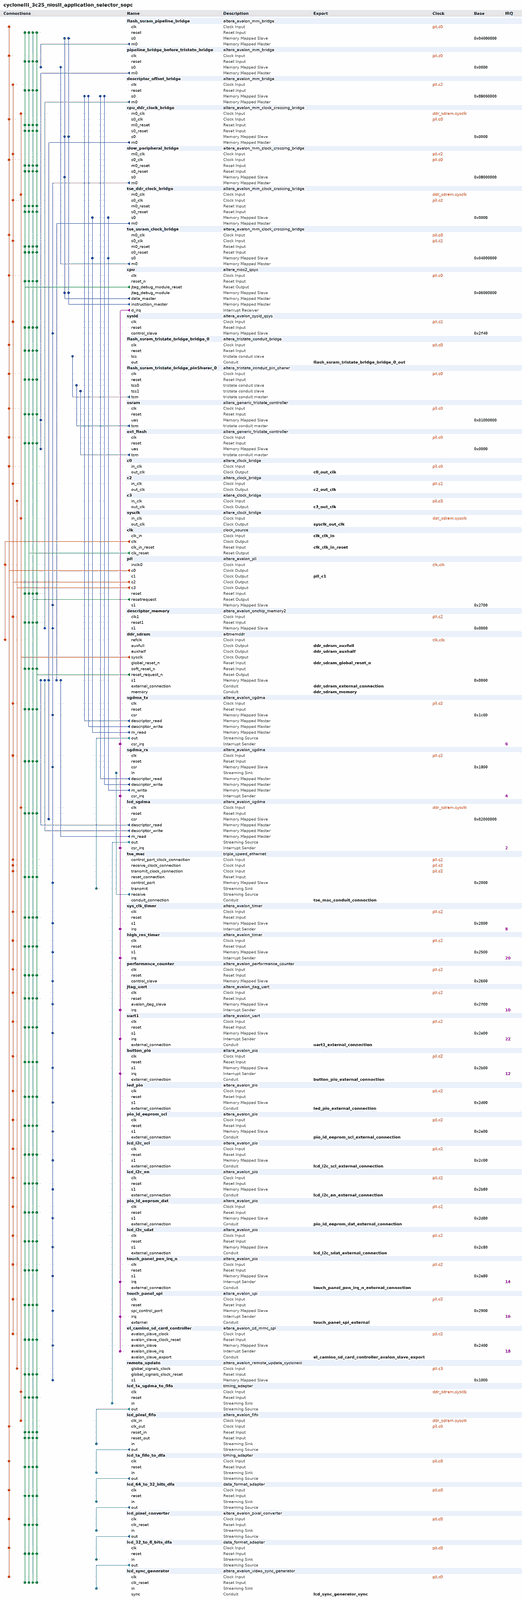
[diagram p0: system contents, whole]
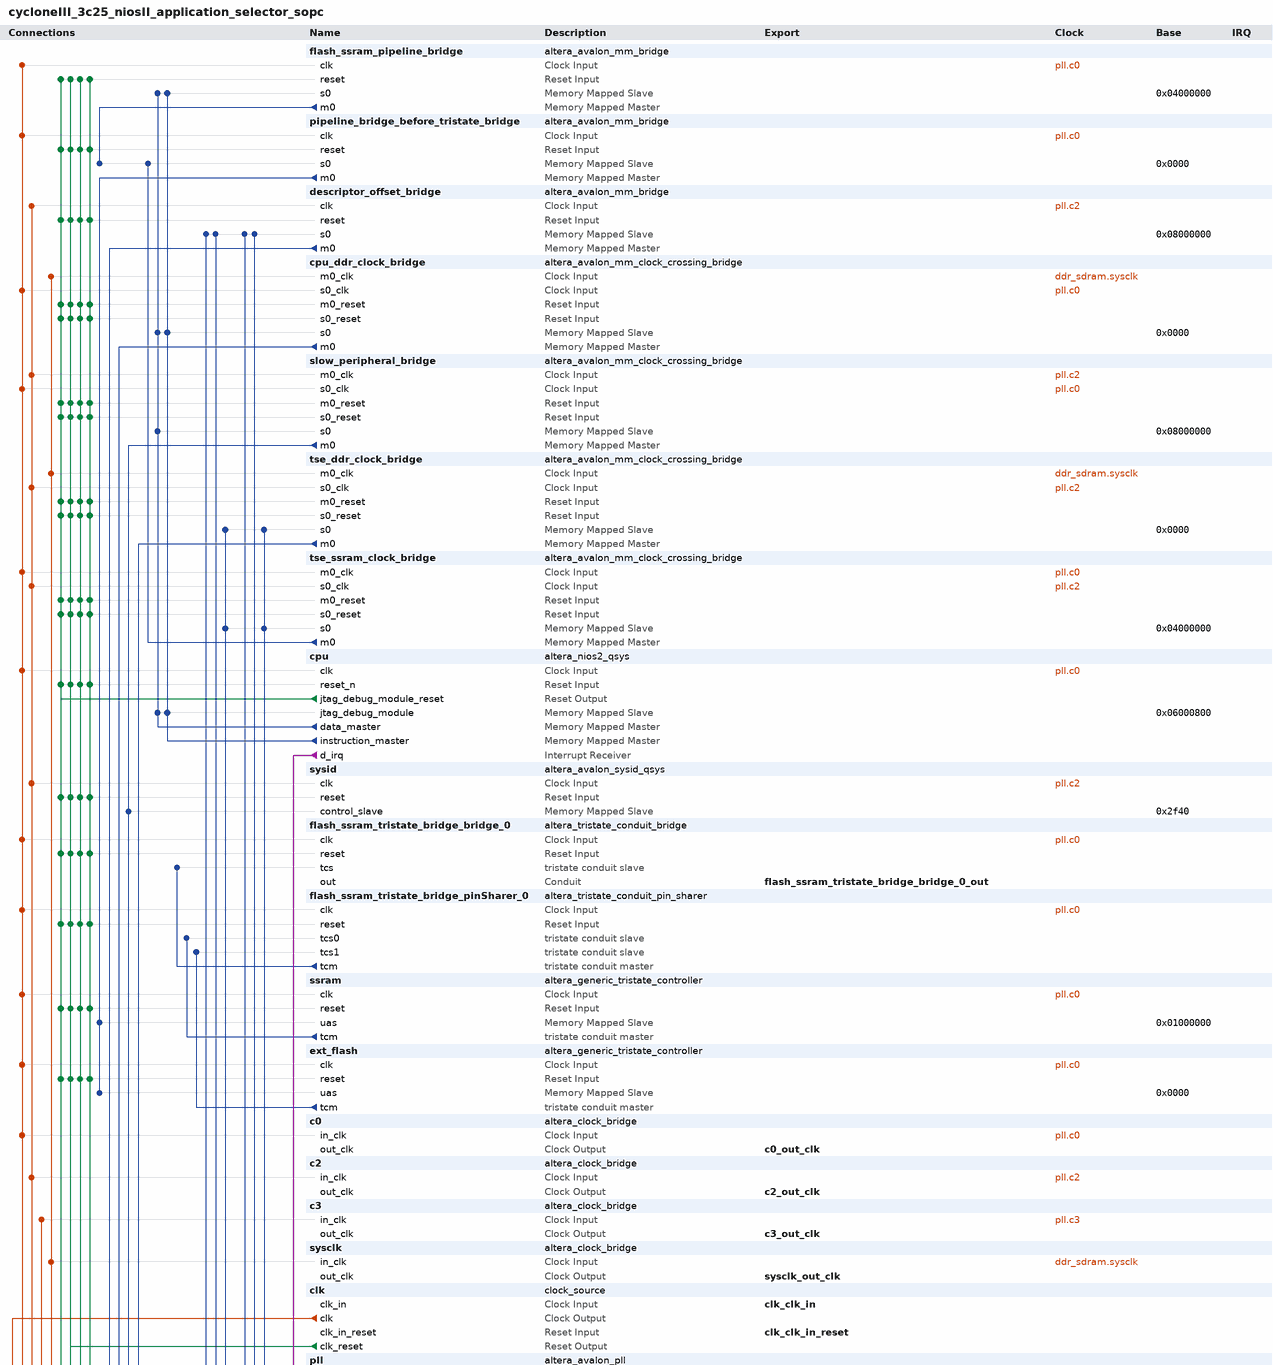
[diagram p1: system contents, upper part]
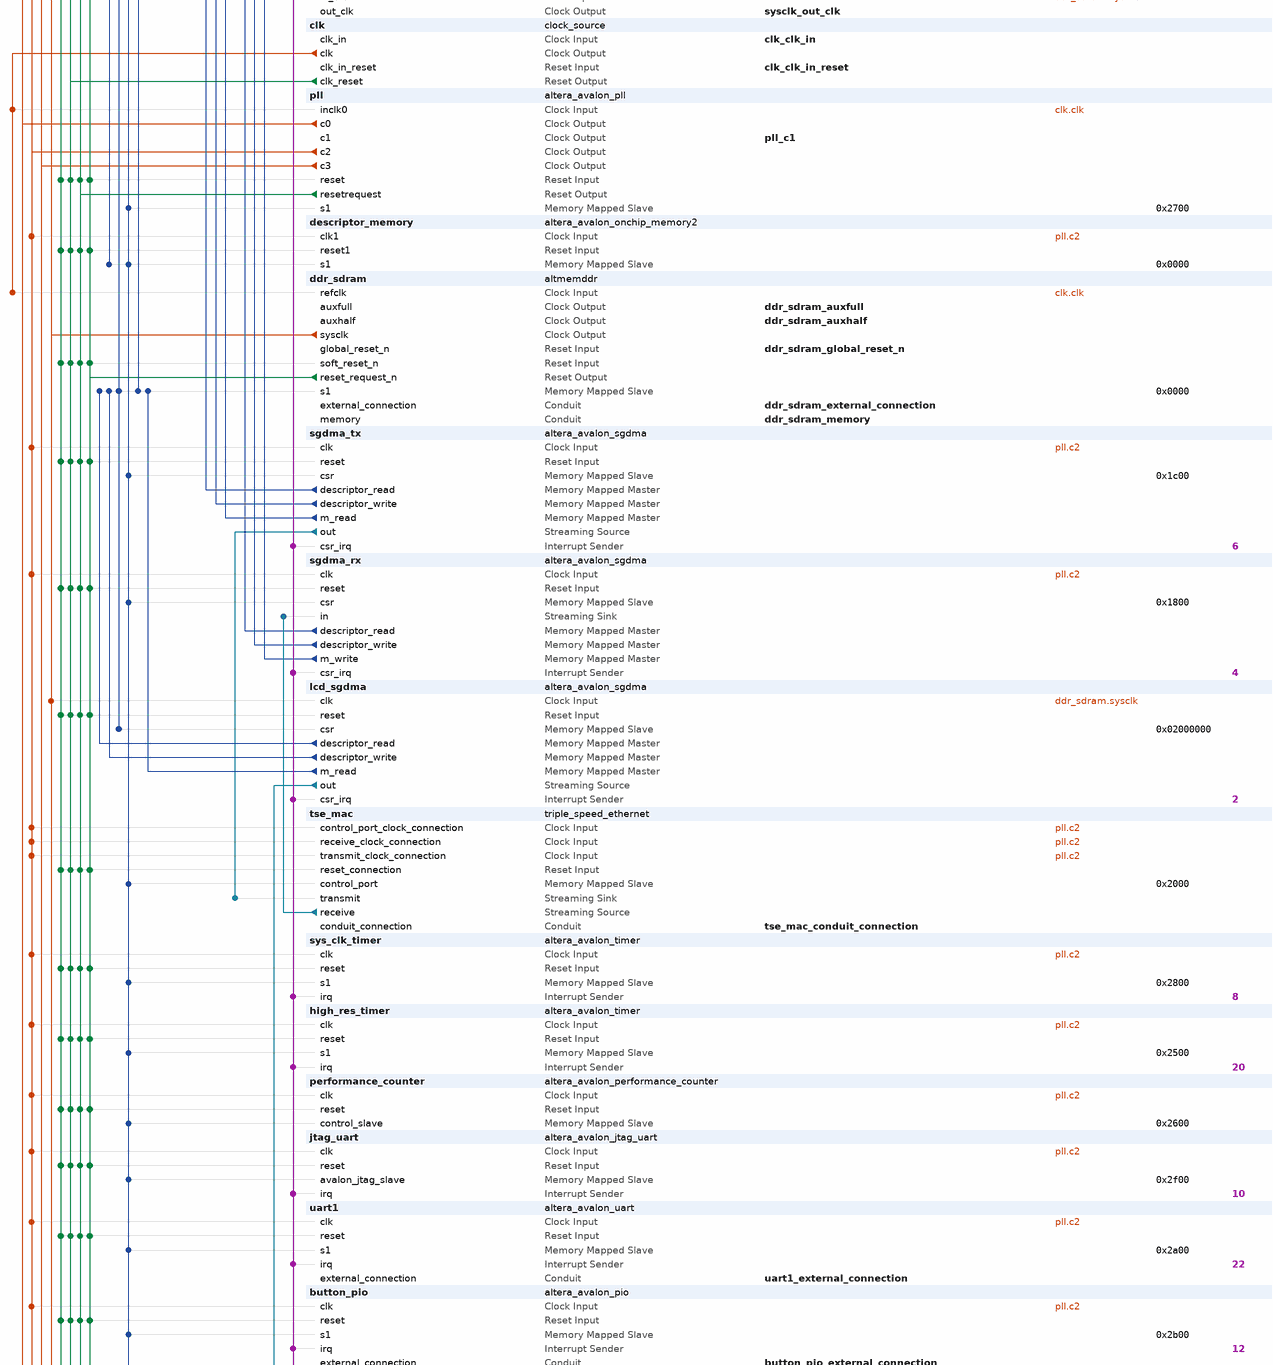
[diagram p2: system contents, middle part]
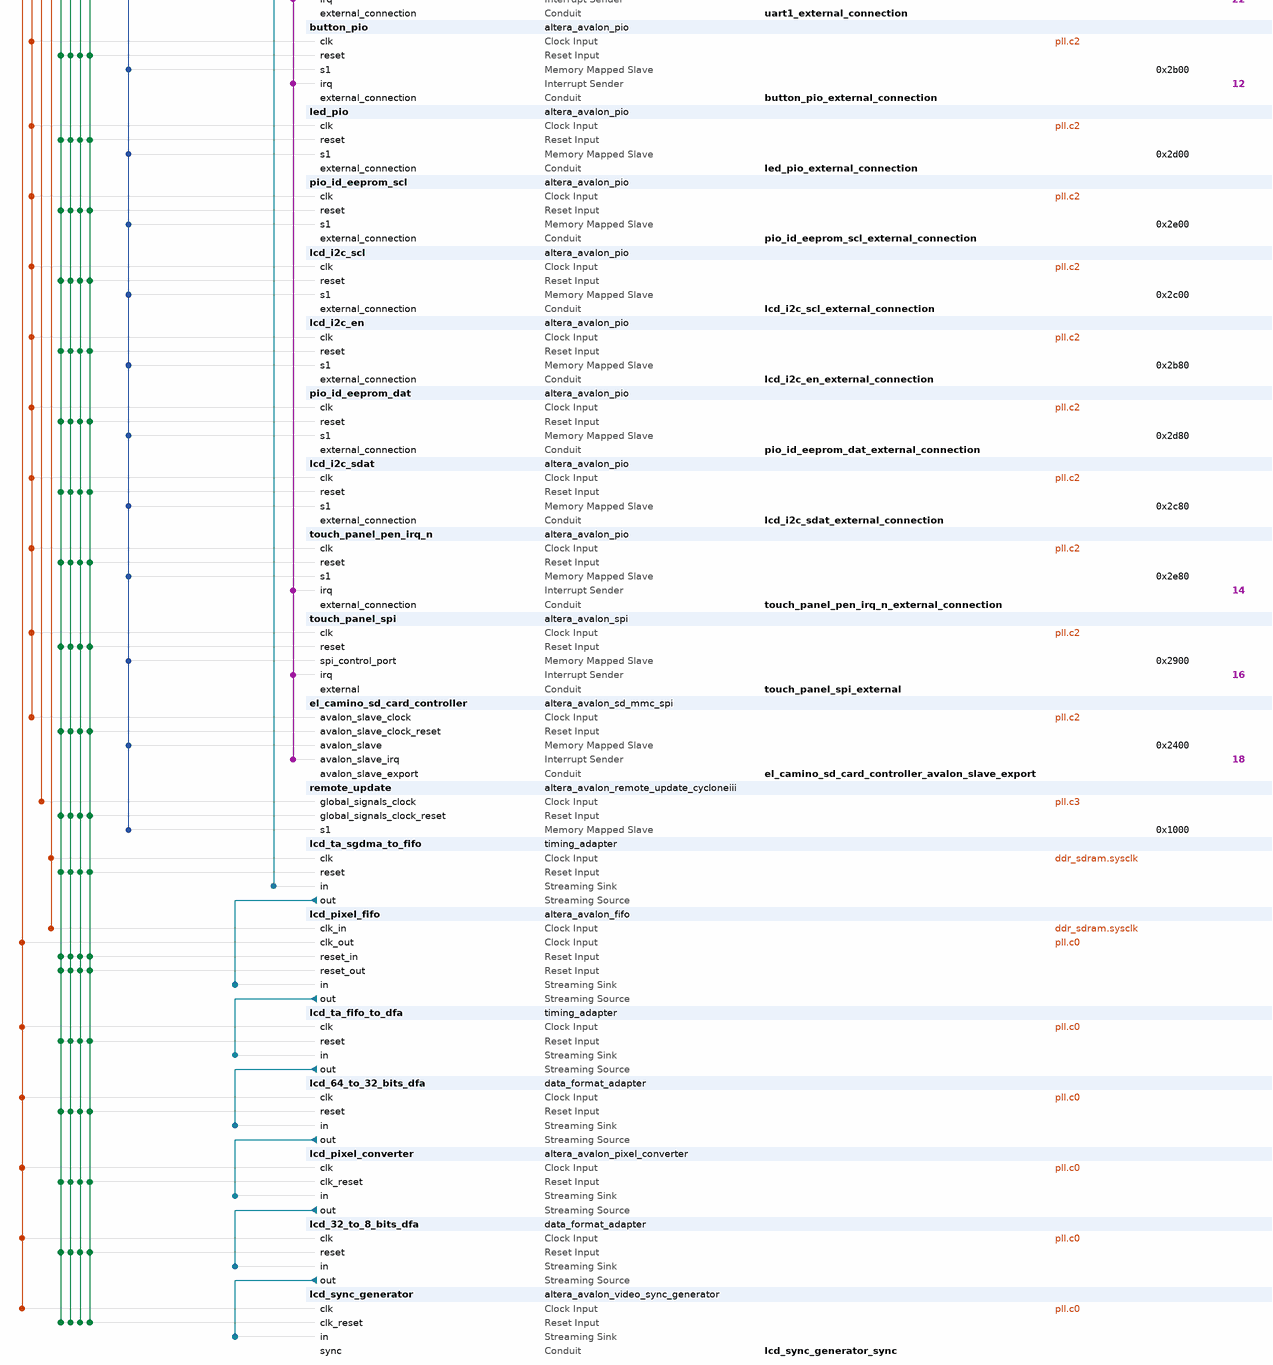
[diagram p3: system contents, lower part]
# Platform Designer (Qsys) system cycloneIII_3c25_niosII_application_selector_sopc, Cyclone III EP3C25F324C8
# Parameters at their usual value, and those the tool derives, are not listed.
package require -exact qsys 12.1
create_system cycloneIII_3c25_niosII_application_selector_sopc
set_project_property DEVICE_FAMILY {Cyclone III}
set_project_property DEVICE EP3C25F324C8

add_instance flash_ssram_pipeline_bridge altera_avalon_mm_bridge 12.1
set_instance_parameter_value flash_ssram_pipeline_bridge DATA_WIDTH 32
set_instance_parameter_value flash_ssram_pipeline_bridge ADDRESS_WIDTH 25
set_instance_parameter_value flash_ssram_pipeline_bridge ADDRESS_UNITS SYMBOLS
set_instance_parameter_value flash_ssram_pipeline_bridge MAX_PENDING_RESPONSES 10

add_instance pipeline_bridge_before_tristate_bridge altera_avalon_mm_bridge 12.1
set_instance_parameter_value pipeline_bridge_before_tristate_bridge DATA_WIDTH 32
set_instance_parameter_value pipeline_bridge_before_tristate_bridge ADDRESS_WIDTH 25
set_instance_parameter_value pipeline_bridge_before_tristate_bridge ADDRESS_UNITS SYMBOLS
set_instance_parameter_value pipeline_bridge_before_tristate_bridge MAX_PENDING_RESPONSES 7

add_instance descriptor_offset_bridge altera_avalon_mm_bridge 12.1
set_instance_parameter_value descriptor_offset_bridge DATA_WIDTH 256
set_instance_parameter_value descriptor_offset_bridge ADDRESS_WIDTH 12
set_instance_parameter_value descriptor_offset_bridge ADDRESS_UNITS SYMBOLS
set_instance_parameter_value descriptor_offset_bridge MAX_PENDING_RESPONSES 4

add_instance cpu_ddr_clock_bridge altera_avalon_mm_clock_crossing_bridge 12.1
set_instance_parameter_value cpu_ddr_clock_bridge DATA_WIDTH 32
set_instance_parameter_value cpu_ddr_clock_bridge ADDRESS_WIDTH 26
set_instance_parameter_value cpu_ddr_clock_bridge MAX_BURST_SIZE 1
set_instance_parameter_value cpu_ddr_clock_bridge COMMAND_FIFO_DEPTH 8
set_instance_parameter_value cpu_ddr_clock_bridge RESPONSE_FIFO_DEPTH 64
set_instance_parameter_value cpu_ddr_clock_bridge MASTER_SYNC_DEPTH 3
set_instance_parameter_value cpu_ddr_clock_bridge SLAVE_SYNC_DEPTH 3

add_instance slow_peripheral_bridge altera_avalon_mm_clock_crossing_bridge 12.1
set_instance_parameter_value slow_peripheral_bridge DATA_WIDTH 32
set_instance_parameter_value slow_peripheral_bridge ADDRESS_WIDTH 14
set_instance_parameter_value slow_peripheral_bridge MAX_BURST_SIZE 1
set_instance_parameter_value slow_peripheral_bridge COMMAND_FIFO_DEPTH 16
set_instance_parameter_value slow_peripheral_bridge RESPONSE_FIFO_DEPTH 64
set_instance_parameter_value slow_peripheral_bridge MASTER_SYNC_DEPTH 3
set_instance_parameter_value slow_peripheral_bridge SLAVE_SYNC_DEPTH 3

add_instance tse_ddr_clock_bridge altera_avalon_mm_clock_crossing_bridge 12.1
set_instance_parameter_value tse_ddr_clock_bridge DATA_WIDTH 32
set_instance_parameter_value tse_ddr_clock_bridge ADDRESS_WIDTH 25
set_instance_parameter_value tse_ddr_clock_bridge MAX_BURST_SIZE 1
set_instance_parameter_value tse_ddr_clock_bridge COMMAND_FIFO_DEPTH 8
set_instance_parameter_value tse_ddr_clock_bridge RESPONSE_FIFO_DEPTH 64
set_instance_parameter_value tse_ddr_clock_bridge MASTER_SYNC_DEPTH 3
set_instance_parameter_value tse_ddr_clock_bridge SLAVE_SYNC_DEPTH 3

add_instance tse_ssram_clock_bridge altera_avalon_mm_clock_crossing_bridge 12.1
set_instance_parameter_value tse_ssram_clock_bridge DATA_WIDTH 32
set_instance_parameter_value tse_ssram_clock_bridge ADDRESS_WIDTH 25
set_instance_parameter_value tse_ssram_clock_bridge MAX_BURST_SIZE 1
set_instance_parameter_value tse_ssram_clock_bridge COMMAND_FIFO_DEPTH 16
set_instance_parameter_value tse_ssram_clock_bridge RESPONSE_FIFO_DEPTH 64
set_instance_parameter_value tse_ssram_clock_bridge MASTER_SYNC_DEPTH 3
set_instance_parameter_value tse_ssram_clock_bridge SLAVE_SYNC_DEPTH 3

add_instance cpu altera_nios2_qsys 12.1
set_instance_parameter_value cpu manuallyAssignCpuID false
set_instance_parameter_value cpu resetOffset 1048576
set_instance_parameter_value cpu resetSlave ext_flash.uas
set_instance_parameter_value cpu exceptionSlave ssram.uas
set_instance_parameter_value cpu breakSlave cpu.jtag_debug_module
set_instance_parameter_value cpu impl Fast
set_instance_parameter_value cpu icache_size 4096

add_instance sysid altera_avalon_sysid_qsys 12.1
set_instance_parameter_value sysid id 0

add_instance flash_ssram_tristate_bridge_bridge_0 altera_tristate_conduit_bridge 12.1

add_instance flash_ssram_tristate_bridge_pinSharer_0 altera_tristate_conduit_pin_sharer 12.1
set_instance_parameter_value flash_ssram_tristate_bridge_pinSharer_0 NUM_INTERFACES 2
set_instance_parameter_value flash_ssram_tristate_bridge_pinSharer_0 MODULE_ORIGIN_LIST ext_flash.tcm,ext_flash.tcm,ext_flash.tcm,ext_flash.tcm,ext_flash.tcm,ssram.tcm,ssram.tcm,ssram.tcm,ssram.tcm,ssram.tcm,ssram.tcm,ssram.tcm,ssram.tcm
set_instance_parameter_value flash_ssram_tristate_bridge_pinSharer_0 SIGNAL_ORIGIN_LIST address,read_n,write_n,data,chipselect_n,chipselect_n,byteenable_n,outputenable_n,write_n,data,address,reset_n,begintransfer_n
set_instance_parameter_value flash_ssram_tristate_bridge_pinSharer_0 SHARED_SIGNAL_LIST flash_ssram_tristate_bridge_address,read_n_to_the_ext_flash,write_n_to_the_ext_flash,flash_ssram_tristate_bridge_data,select_n_to_the_ext_flash,chipenable1_n_to_the_ssram,bw_n_to_the_ssram,outputenable_n_to_the_ssram,bwe_n_to_the_ssram,flash_ssram_tristate_bridge_data,flash_ssram_tristate_bridge_address,reset_n_to_the_ssram,adsc_n_to_the_ssram

add_instance ssram altera_generic_tristate_controller 12.1
set_instance_parameter_value ssram TCM_ADDRESS_W 20
set_instance_parameter_value ssram TCM_DATA_W 32
set_instance_parameter_value ssram TCM_BYTEENABLE_W 4
set_instance_parameter_value ssram TCM_READ_WAIT 0
set_instance_parameter_value ssram TCM_WRITE_WAIT 0
set_instance_parameter_value ssram TCM_SETUP_WAIT 0
set_instance_parameter_value ssram TCM_DATA_HOLD 0
set_instance_parameter_value ssram TCM_MAX_PENDING_READ_TRANSACTIONS 5
set_instance_parameter_value ssram TCM_TURNAROUND_TIME 2
set_instance_parameter_value ssram TCM_TIMING_UNITS 1
set_instance_parameter_value ssram TCM_READLATENCY 4
set_instance_parameter_value ssram TCM_SYMBOLS_PER_WORD 4
set_instance_parameter_value ssram USE_READ 0
set_instance_parameter_value ssram USE_BEGINTRANSFER 1
set_instance_parameter_value ssram USE_BYTEENABLE 1
set_instance_parameter_value ssram USE_OUTPUTENABLE 1
set_instance_parameter_value ssram USE_RESET_OUTPUT 1
set_instance_parameter_value ssram ACTIVE_LOW_READ 0
set_instance_parameter_value ssram ACTIVE_LOW_BYTEENABLE 1
set_instance_parameter_value ssram ACTIVE_LOW_OUTPUTENABLE 1
set_instance_parameter_value ssram ACTIVE_LOW_BEGINTRANSFER 1
set_instance_parameter_value ssram ACTIVE_LOW_RESET_OUTPUT 1
set_instance_parameter_value ssram CHIPSELECT_THROUGH_READLATENCY 1
set_instance_parameter_value ssram MODULE_ASSIGNMENT_KEYS embeddedsw.configuration.hwClassnameDriverSupportList,embeddedsw.CMacro.SRAM_MEMORY_SIZE,embeddedsw.CMacro.SRAM_MEMORY_UNITS,embeddedsw.CMacro.SSRAM_DATA_WIDTH,embeddedsw.CMacro.SSRAM_READ_LATENCY,embeddedsw.memoryInfo.MEM_INIT_DATA_WIDTH,embeddedsw.memoryInfo.HAS_BYTE_LANE,embeddedsw.memoryInfo.GENERATE_DAT_SYM,embeddedsw.memoryInfo.DAT_SYM_INSTALL_DIR
set_instance_parameter_value ssram MODULE_ASSIGNMENT_VALUES altera_avalon_lan91c111:altera_avalon_cfi_flash,1,1048576,32,2,32,1,1,SIM_DIR
set_instance_parameter_value ssram INTERFACE_ASSIGNMENT_KEYS embeddedsw.configuration.isMemoryDevice
set_instance_parameter_value ssram INTERFACE_ASSIGNMENT_VALUES 1

add_instance ext_flash altera_generic_tristate_controller 12.1
set_instance_parameter_value ext_flash TCM_ADDRESS_W 24
set_instance_parameter_value ext_flash TCM_DATA_W 16
set_instance_parameter_value ext_flash TCM_BYTEENABLE_W 2
set_instance_parameter_value ext_flash TCM_READ_WAIT 100
set_instance_parameter_value ext_flash TCM_WRITE_WAIT 100
set_instance_parameter_value ext_flash TCM_SETUP_WAIT 25
set_instance_parameter_value ext_flash TCM_DATA_HOLD 20
set_instance_parameter_value ext_flash TCM_MAX_PENDING_READ_TRANSACTIONS 3
set_instance_parameter_value ext_flash TCM_TURNAROUND_TIME 2
set_instance_parameter_value ext_flash TCM_TIMING_UNITS 0
set_instance_parameter_value ext_flash TCM_READLATENCY 2
set_instance_parameter_value ext_flash TCM_SYMBOLS_PER_WORD 2
set_instance_parameter_value ext_flash USE_READ 1
set_instance_parameter_value ext_flash USE_BEGINTRANSFER 0
set_instance_parameter_value ext_flash USE_BYTEENABLE 0
set_instance_parameter_value ext_flash USE_OUTPUTENABLE 0
set_instance_parameter_value ext_flash ACTIVE_LOW_READ 1
set_instance_parameter_value ext_flash ACTIVE_LOW_BYTEENABLE 0
set_instance_parameter_value ext_flash ACTIVE_LOW_OUTPUTENABLE 0
set_instance_parameter_value ext_flash ACTIVE_LOW_BEGINTRANSFER 0
set_instance_parameter_value ext_flash CHIPSELECT_THROUGH_READLATENCY 0
set_instance_parameter_value ext_flash MODULE_ASSIGNMENT_KEYS embeddedsw.configuration.hwClassnameDriverSupportList,embeddedsw.configuration.hwClassnameDriverSupportDefault,embeddedsw.CMacro.SETUP_VALUE,embeddedsw.CMacro.WAIT_VALUE,embeddedsw.CMacro.HOLD_VALUE,embeddedsw.CMacro.TIMING_UNITS,embeddedsw.CMacro.SIZE,embeddedsw.memoryInfo.MEM_INIT_DATA_WIDTH,embeddedsw.memoryInfo.HAS_BYTE_LANE,embeddedsw.memoryInfo.IS_FLASH,embeddedsw.memoryInfo.GENERATE_DAT_SYM,embeddedsw.memoryInfo.GENERATE_FLASH,embeddedsw.memoryInfo.DAT_SYM_INSTALL_DIR,embeddedsw.memoryInfo.FLASH_INSTALL_DIR
set_instance_parameter_value ext_flash MODULE_ASSIGNMENT_VALUES {altera_avalon_lan91c111:altera_avalon_cfi_flash,altera_avalon_cfi_flash,25,100,20,"ns",16777216u,16,1,1,1,1,SIM_DIR,APP_DIR}
set_instance_parameter_value ext_flash INTERFACE_ASSIGNMENT_KEYS embeddedsw.configuration.isFlash,embeddedsw.configuration.isMemoryDevice,embeddedsw.configuration.isNonVolatileStorage
set_instance_parameter_value ext_flash INTERFACE_ASSIGNMENT_VALUES 1,1,1

add_instance c0 altera_clock_bridge 12.1
set_instance_parameter_value c0 DERIVED_CLOCK_RATE 100000000
set_instance_parameter_value c0 EXPLICIT_CLOCK_RATE 0

add_instance c2 altera_clock_bridge 12.1
set_instance_parameter_value c2 DERIVED_CLOCK_RATE 60000000
set_instance_parameter_value c2 EXPLICIT_CLOCK_RATE 0

add_instance c3 altera_clock_bridge 12.1
set_instance_parameter_value c3 DERIVED_CLOCK_RATE 40000000
set_instance_parameter_value c3 EXPLICIT_CLOCK_RATE 0

add_instance sysclk altera_clock_bridge 12.1
set_instance_parameter_value sysclk DERIVED_CLOCK_RATE 66500000
set_instance_parameter_value sysclk EXPLICIT_CLOCK_RATE 0

add_instance clk clock_source 12.1
set_instance_parameter_value clk clockFrequency 50000000

add_instance pll altera_avalon_pll 12.1
set_instance_parameter_value pll c0 {tap c0 mult 2 div 1 phase 0 enabled true inputfreq 50000000 outputfreq 100000000}
set_instance_parameter_value pll c1 {tap c1 mult 2 div 1 phase -2000 enabled true inputfreq 50000000 outputfreq 100000000}
set_instance_parameter_value pll c2 {tap c2 mult 6 div 5 phase 0 enabled true inputfreq 50000000 outputfreq 60000000}
set_instance_parameter_value pll c3 {tap c3 mult 4 div 5 phase 0 enabled true inputfreq 50000000 outputfreq 40000000}
set_instance_parameter_value pll c4 {tap c4 mult 1 div 1 phase 0 enabled false inputfreq 0 outputfreq 0}
set_instance_parameter_value pll c5 {tap c5 mult 1 div 1 phase 0 enabled false inputfreq 0 outputfreq 0}
set_instance_parameter_value pll c6 {tap c6 mult 1 div 1 phase 0 enabled false inputfreq 0 outputfreq 0}
set_instance_parameter_value pll c7 {tap c7 mult 1 div 1 phase 0 enabled false inputfreq 0 outputfreq 0}
set_instance_parameter_value pll c8 {tap c8 mult 1 div 1 phase 0 enabled false inputfreq 0 outputfreq 0}
set_instance_parameter_value pll c9 {tap c9 mult 1 div 1 phase 0 enabled false inputfreq 0 outputfreq 0}
set_instance_parameter_value pll e0 {tap e0 mult 1 div 1 phase 0 enabled false inputfreq 0 outputfreq 0}
set_instance_parameter_value pll e1 {tap e1 mult 1 div 1 phase 0 enabled false inputfreq 0 outputfreq 0}
set_instance_parameter_value pll e2 {tap e2 mult 1 div 1 phase 0 enabled false inputfreq 0 outputfreq 0}
set_instance_parameter_value pll e3 {tap e3 mult 1 div 1 phase 0 enabled false inputfreq 0 outputfreq 0}
set_instance_parameter_value pll inputClockRate 50000000
set_instance_parameter_value pll lockedOutputPortOption Export
set_instance_parameter_value pll pfdenaInputPortOption Register
set_instance_parameter_value pll resetInputPortOption Register

add_instance descriptor_memory altera_avalon_onchip_memory2 12.1
set_instance_parameter_value descriptor_memory dataWidth 32
set_instance_parameter_value descriptor_memory dualPort false
set_instance_parameter_value descriptor_memory initMemContent true
set_instance_parameter_value descriptor_memory initializationFileName descriptor_memory
set_instance_parameter_value descriptor_memory memorySize 4096

add_instance ddr_sdram altmemddr 12.1
set_instance_parameter_value ddr_sdram pipeline_commands false
set_instance_parameter_value ddr_sdram debug_en false
set_instance_parameter_value ddr_sdram export_debug_port false
set_instance_parameter_value ddr_sdram use_generated_memory_model true
set_instance_parameter_value ddr_sdram dedicated_memory_clk_phase_label {Dedicated memory clock phase:}
set_instance_parameter_value ddr_sdram mem_if_clk_mhz 133.0
set_instance_parameter_value ddr_sdram quartus_project_exists false
set_instance_parameter_value ddr_sdram local_if_drate Half
set_instance_parameter_value ddr_sdram enable_v72_rsu false
set_instance_parameter_value ddr_sdram local_if_clk_mhz_label 66.5
set_instance_parameter_value ddr_sdram new_variant false
set_instance_parameter_value ddr_sdram mem_if_memtype {DDR SDRAM}
set_instance_parameter_value ddr_sdram pll_ref_clk_mhz 50.0
set_instance_parameter_value ddr_sdram mem_if_clk_ps_label {(7519 ps)}
set_instance_parameter_value ddr_sdram family {Cyclone III}
set_instance_parameter_value ddr_sdram project_family {Cyclone III}
set_instance_parameter_value ddr_sdram speed_grade 8
set_instance_parameter_value ddr_sdram dedicated_memory_clk_phase 0
set_instance_parameter_value ddr_sdram pll_ref_clk_ps_label {(20000 ps)}
set_instance_parameter_value ddr_sdram avalon_burst_length 1
set_instance_parameter_value ddr_sdram mem_if_clk_pair_count 1
set_instance_parameter_value ddr_sdram mem_if_cs_per_dimm 1
set_instance_parameter_value ddr_sdram pre_latency_label {Fix read latency at:}
set_instance_parameter_value ddr_sdram dedicated_memory_clk_en false
set_instance_parameter_value ddr_sdram mirror_addressing 0
set_instance_parameter_value ddr_sdram mem_if_bankaddr_width 2
set_instance_parameter_value ddr_sdram register_control_word_9 0000
set_instance_parameter_value ddr_sdram mem_if_rowaddr_width 13
set_instance_parameter_value ddr_sdram mem_dyn_deskew_en false
set_instance_parameter_value ddr_sdram post_latency_label {cycles (0 cycles=minimum latency, non-deterministic)}
set_instance_parameter_value ddr_sdram mem_if_dm_pins_en Yes
set_instance_parameter_value ddr_sdram local_if_dwidth_label 64
set_instance_parameter_value ddr_sdram register_control_word_7 0000
set_instance_parameter_value ddr_sdram register_control_word_8 0000
set_instance_parameter_value ddr_sdram mem_if_preset {PSC A2S56D40CTP-G5}
set_instance_parameter_value ddr_sdram mem_if_pchaddr_bit 10
set_instance_parameter_value ddr_sdram WIDTH_RATIO 4
set_instance_parameter_value ddr_sdram vendor Other
set_instance_parameter_value ddr_sdram register_control_word_3 0000
set_instance_parameter_value ddr_sdram register_control_word_4 0000
set_instance_parameter_value ddr_sdram chip_or_dimm {Discrete Device}
set_instance_parameter_value ddr_sdram register_control_word_5 0000
set_instance_parameter_value ddr_sdram register_control_word_6 0000
set_instance_parameter_value ddr_sdram mem_fmax 200.0
set_instance_parameter_value ddr_sdram register_control_word_0 0000
set_instance_parameter_value ddr_sdram register_control_word_size 4
set_instance_parameter_value ddr_sdram register_control_word_1 0000
set_instance_parameter_value ddr_sdram register_control_word_2 0000
set_instance_parameter_value ddr_sdram register_control_word_11 0000
set_instance_parameter_value ddr_sdram register_control_word_10 0000
set_instance_parameter_value ddr_sdram mem_if_cs_width 1
set_instance_parameter_value ddr_sdram mem_if_preset_rlat 0
set_instance_parameter_value ddr_sdram mem_if_cs_per_rank 1
set_instance_parameter_value ddr_sdram fast_simulation_en FAST
set_instance_parameter_value ddr_sdram register_control_word_15 0000
set_instance_parameter_value ddr_sdram register_control_word_14 0000
set_instance_parameter_value ddr_sdram mem_if_dwidth 16
set_instance_parameter_value ddr_sdram mem_if_dq_per_dqs 8
set_instance_parameter_value ddr_sdram mem_if_coladdr_width 9
set_instance_parameter_value ddr_sdram register_control_word_13 0000
set_instance_parameter_value ddr_sdram register_control_word_12 0000
set_instance_parameter_value ddr_sdram mem_tiha_ps 600
set_instance_parameter_value ddr_sdram mem_tdsh_ck 0.2
set_instance_parameter_value ddr_sdram mem_if_trfc_ns 70.0
set_instance_parameter_value ddr_sdram mem_tqh_ck 0.36
set_instance_parameter_value ddr_sdram mem_tisa_ps 600
set_instance_parameter_value ddr_sdram mem_tdss_ck 0.2
set_instance_parameter_value ddr_sdram mem_trtp_ns 0.0
set_instance_parameter_value ddr_sdram mem_if_tinit_us 200.0
set_instance_parameter_value ddr_sdram mem_if_trcd_ns 15.0
set_instance_parameter_value ddr_sdram mem_if_twtr_ck 2
set_instance_parameter_value ddr_sdram mem_trrd_ns 0.0
set_instance_parameter_value ddr_sdram mem_tdqss_ck 0.28
set_instance_parameter_value ddr_sdram mem_tqhs_ps 500
set_instance_parameter_value ddr_sdram mem_tdsa_ps 400
set_instance_parameter_value ddr_sdram mem_tac_ps 700
set_instance_parameter_value ddr_sdram mem_tdha_ps 400
set_instance_parameter_value ddr_sdram mem_if_tras_ns 40.0
set_instance_parameter_value ddr_sdram mem_if_twr_ns 15.0
set_instance_parameter_value ddr_sdram mem_tdqsck_ps 550
set_instance_parameter_value ddr_sdram mem_if_trp_ns 15.0
set_instance_parameter_value ddr_sdram mem_tdqsq_ps 400
set_instance_parameter_value ddr_sdram mem_if_tmrd_ns 10.0
set_instance_parameter_value ddr_sdram mem_tfaw_ns 0.0
set_instance_parameter_value ddr_sdram mem_if_trefi_us 7.0
set_instance_parameter_value ddr_sdram mem_tcl_40_fmax 533.0
set_instance_parameter_value ddr_sdram mem_odt Disabled
set_instance_parameter_value ddr_sdram mp_WLH_percent 0.6
set_instance_parameter_value ddr_sdram mem_drv_str Normal
set_instance_parameter_value ddr_sdram mp_DH_percent 0.5
set_instance_parameter_value ddr_sdram input_period 0
set_instance_parameter_value ddr_sdram mp_QH_percent 0.5
set_instance_parameter_value ddr_sdram mp_QHS_percent 0.5
set_instance_parameter_value ddr_sdram mem_tcl_30_fmax 200.0
set_instance_parameter_value ddr_sdram ac_clk_select 90
set_instance_parameter_value ddr_sdram mp_DQSQ_percent 0.65
set_instance_parameter_value ddr_sdram mp_DS_percent 0.6
set_instance_parameter_value ddr_sdram pll_reconfig_ports_en false
set_instance_parameter_value ddr_sdram mem_btype Sequential
set_instance_parameter_value ddr_sdram mp_IS_percent 0.7
set_instance_parameter_value ddr_sdram mem_tcl 3.0
set_instance_parameter_value ddr_sdram mp_DQSS_percent 0.5
set_instance_parameter_value ddr_sdram export_bank_info false
set_instance_parameter_value ddr_sdram mp_DSS_percent 0.6
set_instance_parameter_value ddr_sdram mem_dll_en Yes
set_instance_parameter_value ddr_sdram ac_phase 90
set_instance_parameter_value ddr_sdram mem_if_oct_en false
set_instance_parameter_value ddr_sdram mem_tcl_60_fmax 533.0
set_instance_parameter_value ddr_sdram mp_DSH_percent 0.6
set_instance_parameter_value ddr_sdram mem_if_dqsn_en false
set_instance_parameter_value ddr_sdram enable_mp_calibration true
set_instance_parameter_value ddr_sdram mp_IH_percent 0.6
set_instance_parameter_value ddr_sdram mem_tcl_15_fmax 533.0
set_instance_parameter_value ddr_sdram dll_external false
set_instance_parameter_value ddr_sdram mem_bl 4
set_instance_parameter_value ddr_sdram mp_WLS_percent 0.7
set_instance_parameter_value ddr_sdram mem_tcl_50_fmax 533.0
set_instance_parameter_value ddr_sdram mp_DQSCK_percent 0.5
set_instance_parameter_value ddr_sdram mem_tcl_25_fmax 200.0
set_instance_parameter_value ddr_sdram mem_tcl_20_fmax 133.333
set_instance_parameter_value ddr_sdram cfg_reorder_data true
set_instance_parameter_value ddr_sdram ctl_ecc_en false
set_instance_parameter_value ddr_sdram ctl_hrb_en false
set_instance_parameter_value ddr_sdram ref_clk_source clk
set_instance_parameter_value ddr_sdram cfg_data_reordering_type INTER_BANK
set_instance_parameter_value ddr_sdram ctl_powerdn_en false
set_instance_parameter_value ddr_sdram multicast_wr_en false
set_instance_parameter_value ddr_sdram auto_powerdn_cycles 0
set_instance_parameter_value ddr_sdram ctl_self_refresh_en false
set_instance_parameter_value ddr_sdram cfg_starve_limit 10
set_instance_parameter_value ddr_sdram ctl_latency 5
set_instance_parameter_value ddr_sdram tool_context SOPC_BUILDER
set_instance_parameter_value ddr_sdram mem_addr_mapping CHIP_ROW_BANK_COL
set_instance_parameter_value ddr_sdram burst_merge_en false
set_instance_parameter_value ddr_sdram user_refresh_en false
set_instance_parameter_value ddr_sdram qsys_mode true
set_instance_parameter_value ddr_sdram clk_source_sharing_en false
set_instance_parameter_value ddr_sdram ctl_lookahead_depth 4
set_instance_parameter_value ddr_sdram ctl_autopch_en false
set_instance_parameter_value ddr_sdram ctl_dynamic_bank_allocation false
set_instance_parameter_value ddr_sdram ctl_dynamic_bank_num 4
set_instance_parameter_value ddr_sdram local_if_type_avalon true
set_instance_parameter_value ddr_sdram csr_en false
set_instance_parameter_value ddr_sdram ctl_auto_correct_en false
set_instance_parameter_value ddr_sdram auto_powerdn_en false
set_instance_parameter_value ddr_sdram phy_if_type_afi true
set_instance_parameter_value ddr_sdram controller_type hp_ctl
set_instance_parameter_value ddr_sdram max_local_size 4
set_instance_parameter_value ddr_sdram mem_srtr Normal
set_instance_parameter_value ddr_sdram mem_mpr_loc {Predefined Pattern}
set_instance_parameter_value ddr_sdram dss_tinit_rst_us 200.0
set_instance_parameter_value ddr_sdram mem_tcl_90_fmax 400.0
set_instance_parameter_value ddr_sdram mem_rtt_wr {Dynamic ODT off}
set_instance_parameter_value ddr_sdram mem_tcl_100_fmax 400.0
set_instance_parameter_value ddr_sdram mem_pasr {Full Array}
set_instance_parameter_value ddr_sdram mem_asrm {Manual SR Reference (SRT)}
set_instance_parameter_value ddr_sdram mem_mpr_oper {Predefined Pattern}
set_instance_parameter_value ddr_sdram mem_tcl_80_fmax 400.0
set_instance_parameter_value ddr_sdram mem_drv_impedance RZQ/7
set_instance_parameter_value ddr_sdram mem_rtt_nom {ODT Disabled}
set_instance_parameter_value ddr_sdram mem_tcl_70_fmax 400.0
set_instance_parameter_value ddr_sdram mem_wtcl 5.0
set_instance_parameter_value ddr_sdram mem_dll_pch {Fast Exit}
set_instance_parameter_value ddr_sdram mem_atcl Disabled
set_instance_parameter_value ddr_sdram board_settings_valid true
set_instance_parameter_value ddr_sdram t_IH 0.6
set_instance_parameter_value ddr_sdram board_intra_DQS_group_skew 0.02
set_instance_parameter_value ddr_sdram isi_DQS 0.0
set_instance_parameter_value ddr_sdram addr_cmd_slew_rate 1.0
set_instance_parameter_value ddr_sdram board_tpd_inter_DIMM 0.05
set_instance_parameter_value ddr_sdram board_addresscmd_CK_skew 0.0
set_instance_parameter_value ddr_sdram t_DS_calculated 0.400
set_instance_parameter_value ddr_sdram isi_addresscmd_hold 0.0
set_instance_parameter_value ddr_sdram t_IS 0.6
set_instance_parameter_value ddr_sdram restore_default_toggle false
set_instance_parameter_value ddr_sdram dqs_dqsn_slew_rate 2.0
set_instance_parameter_value ddr_sdram dq_slew_rate 1.0
set_instance_parameter_value ddr_sdram board_inter_DQS_group_skew 0.02
set_instance_parameter_value ddr_sdram isi_addresscmd_setup 0.0
set_instance_parameter_value ddr_sdram board_minCK_DQS_skew -0.01
set_instance_parameter_value ddr_sdram t_IS_calculated 0.600
set_instance_parameter_value ddr_sdram num_slots_or_devices 1
set_instance_parameter_value ddr_sdram board_maxCK_DQS_skew 0.01
set_instance_parameter_value ddr_sdram board_skew_ps 20
set_instance_parameter_value ddr_sdram t_DH 0.4
set_instance_parameter_value ddr_sdram ck_ckn_slew_rate 2.0
set_instance_parameter_value ddr_sdram isi_DQ 0.0
set_instance_parameter_value ddr_sdram t_IH_calculated 0.600
set_instance_parameter_value ddr_sdram t_DH_calculated 0.400
set_instance_parameter_value ddr_sdram t_DS 0.4

add_instance sgdma_tx altera_avalon_sgdma 12.1
set_instance_parameter_value sgdma_tx enableBurstTransfers false
set_instance_parameter_value sgdma_tx enableUnalignedTransfers false
set_instance_parameter_value sgdma_tx readBlockDataWidth 32
set_instance_parameter_value sgdma_tx sinkErrorWidth 0
set_instance_parameter_value sgdma_tx sourceErrorWidth 1
set_instance_parameter_value sgdma_tx transferMode MEMORY_TO_STREAM
set_instance_parameter_value sgdma_tx writeBurstcountWidth 4

add_instance sgdma_rx altera_avalon_sgdma 12.1
set_instance_parameter_value sgdma_rx enableBurstTransfers false
set_instance_parameter_value sgdma_rx enableUnalignedTransfers false
set_instance_parameter_value sgdma_rx readBlockDataWidth 32
set_instance_parameter_value sgdma_rx sinkErrorWidth 6
set_instance_parameter_value sgdma_rx sourceErrorWidth 0
set_instance_parameter_value sgdma_rx transferMode STREAM_TO_MEMORY
set_instance_parameter_value sgdma_rx writeBurstcountWidth 4

add_instance lcd_sgdma altera_avalon_sgdma 12.1
set_instance_parameter_value lcd_sgdma enableBurstTransfers false
set_instance_parameter_value lcd_sgdma enableUnalignedTransfers false
set_instance_parameter_value lcd_sgdma readBlockDataWidth 64
set_instance_parameter_value lcd_sgdma sinkErrorWidth 0
set_instance_parameter_value lcd_sgdma sourceErrorWidth 0
set_instance_parameter_value lcd_sgdma transferMode MEMORY_TO_STREAM
set_instance_parameter_value lcd_sgdma writeBurstcountWidth 4

add_instance tse_mac triple_speed_ethernet 12.1
set_instance_parameter_value tse_mac atlanticSinkClockRate 0
set_instance_parameter_value tse_mac atlanticSinkClockSource pll
set_instance_parameter_value tse_mac atlanticSourceClockRate 0
set_instance_parameter_value tse_mac atlanticSourceClockSource pll
set_instance_parameter_value tse_mac avalonSlaveClockRate 0
set_instance_parameter_value tse_mac avalonSlaveClockSource pll
set_instance_parameter_value tse_mac avalonStNeighbours {unassigned=unassigned}
set_instance_parameter_value tse_mac channel_count 1
set_instance_parameter_value tse_mac core_variation MAC_ONLY
set_instance_parameter_value tse_mac core_version 3073
set_instance_parameter_value tse_mac crc32check16bit 0
set_instance_parameter_value tse_mac crc32dwidth 8
set_instance_parameter_value tse_mac crc32gendelay 6
set_instance_parameter_value tse_mac crc32s1l2_extern false
set_instance_parameter_value tse_mac cust_version 0
set_instance_parameter_value tse_mac dataBitsPerSymbol 8
set_instance_parameter_value tse_mac dev_version 3073
set_instance_parameter_value tse_mac eg_addr 9
set_instance_parameter_value tse_mac ena_hash true
set_instance_parameter_value tse_mac enable_alt_reconfig false
set_instance_parameter_value tse_mac enable_clk_sharing false
set_instance_parameter_value tse_mac enable_ena 32
set_instance_parameter_value tse_mac enable_fifoless false
set_instance_parameter_value tse_mac enable_gmii_loopback true
set_instance_parameter_value tse_mac enable_hd_logic true
set_instance_parameter_value tse_mac enable_mac_flow_ctrl false
set_instance_parameter_value tse_mac enable_mac_txaddr_set true
set_instance_parameter_value tse_mac enable_mac_vlan false
set_instance_parameter_value tse_mac enable_maclite false
set_instance_parameter_value tse_mac enable_magic_detect true
set_instance_parameter_value tse_mac enable_multi_channel false
set_instance_parameter_value tse_mac enable_pkt_class true
set_instance_parameter_value tse_mac enable_pma false
set_instance_parameter_value tse_mac enable_ptp_1step false
set_instance_parameter_value tse_mac enable_reg_sharing false
set_instance_parameter_value tse_mac enable_sgmii false
set_instance_parameter_value tse_mac enable_shift16 true
set_instance_parameter_value tse_mac enable_sup_addr true
set_instance_parameter_value tse_mac enable_timestamping false
set_instance_parameter_value tse_mac enable_use_internal_fifo true
set_instance_parameter_value tse_mac export_calblkclk false
set_instance_parameter_value tse_mac export_pwrdn false
set_instance_parameter_value tse_mac ext_stat_cnt_ena false
set_instance_parameter_value tse_mac gigeAdvanceMode false
set_instance_parameter_value tse_mac ifGMII MII_GMII
set_instance_parameter_value tse_mac ifPCSuseEmbeddedSerdes false
set_instance_parameter_value tse_mac ing_addr 9
set_instance_parameter_value tse_mac insert_ta true
set_instance_parameter_value tse_mac maclite_gige false
set_instance_parameter_value tse_mac max_channels 1
set_instance_parameter_value tse_mac mdio_clk_div 40
set_instance_parameter_value tse_mac phy_identifier 0
set_instance_parameter_value tse_mac ramType AUTO
set_instance_parameter_value tse_mac reset_level 1
set_instance_parameter_value tse_mac starting_channel_number 0
set_instance_parameter_value tse_mac stat_cnt_ena true
set_instance_parameter_value tse_mac timingAdapterName timingAdapter
set_instance_parameter_value tse_mac toolContext SOPC_BUILDER
set_instance_parameter_value tse_mac transceiver_type GXB
set_instance_parameter_value tse_mac tstamp_fp_width 4
set_instance_parameter_value tse_mac uiHostClockFrequency 0
set_instance_parameter_value tse_mac uiMDIOFreq {0.0 MHz}
set_instance_parameter_value tse_mac useLvds false
set_instance_parameter_value tse_mac useMAC true
set_instance_parameter_value tse_mac useMDIO true
set_instance_parameter_value tse_mac usePCS false
set_instance_parameter_value tse_mac use_sync_reset true

add_instance sys_clk_timer altera_avalon_timer 12.1
set_instance_parameter_value sys_clk_timer period 10.0
set_instance_parameter_value sys_clk_timer periodUnits MSEC
set_instance_parameter_value sys_clk_timer timerPreset FULL_FEATURED

add_instance high_res_timer altera_avalon_timer 12.1
set_instance_parameter_value high_res_timer period 10.0
set_instance_parameter_value high_res_timer periodUnits USEC
set_instance_parameter_value high_res_timer timerPreset FULL_FEATURED

add_instance performance_counter altera_avalon_performance_counter 12.1
set_instance_parameter_value performance_counter numberOfSections 1

add_instance jtag_uart altera_avalon_jtag_uart 12.1
set_instance_parameter_value jtag_uart readBufferDepth 8
set_instance_parameter_value jtag_uart readIRQThreshold 4
set_instance_parameter_value jtag_uart simInteractiveOptions INTERACTIVE_ASCII_OUTPUT
set_instance_parameter_value jtag_uart useRegistersForReadBuffer true
set_instance_parameter_value jtag_uart useRegistersForWriteBuffer true
set_instance_parameter_value jtag_uart writeBufferDepth 8
set_instance_parameter_value jtag_uart writeIRQThreshold 4

add_instance uart1 altera_avalon_uart 12.1
set_instance_parameter_value uart1 baud 115200
set_instance_parameter_value uart1 dataBits 8
set_instance_parameter_value uart1 fixedBaud true
set_instance_parameter_value uart1 parity NONE
set_instance_parameter_value uart1 stopBits 1

add_instance button_pio altera_avalon_pio 12.1
set_instance_parameter_value button_pio captureEdge true
set_instance_parameter_value button_pio direction Input
set_instance_parameter_value button_pio generateIRQ true
set_instance_parameter_value button_pio irqType EDGE
set_instance_parameter_value button_pio simDoTestBenchWiring true
set_instance_parameter_value button_pio simDrivenValue 15
set_instance_parameter_value button_pio width 4

add_instance led_pio altera_avalon_pio 12.1
set_instance_parameter_value led_pio direction Output
set_instance_parameter_value led_pio width 2

add_instance pio_id_eeprom_scl altera_avalon_pio 12.1
set_instance_parameter_value pio_id_eeprom_scl direction Output
set_instance_parameter_value pio_id_eeprom_scl width 1

add_instance lcd_i2c_scl altera_avalon_pio 12.1
set_instance_parameter_value lcd_i2c_scl direction Output
set_instance_parameter_value lcd_i2c_scl width 1

add_instance lcd_i2c_en altera_avalon_pio 12.1
set_instance_parameter_value lcd_i2c_en direction Output
set_instance_parameter_value lcd_i2c_en width 1

add_instance pio_id_eeprom_dat altera_avalon_pio 12.1
set_instance_parameter_value pio_id_eeprom_dat direction Bidir
set_instance_parameter_value pio_id_eeprom_dat simDoTestBenchWiring true
set_instance_parameter_value pio_id_eeprom_dat width 1

add_instance lcd_i2c_sdat altera_avalon_pio 12.1
set_instance_parameter_value lcd_i2c_sdat direction Bidir
set_instance_parameter_value lcd_i2c_sdat simDoTestBenchWiring true
set_instance_parameter_value lcd_i2c_sdat width 1

add_instance touch_panel_pen_irq_n altera_avalon_pio 12.1
set_instance_parameter_value touch_panel_pen_irq_n captureEdge true
set_instance_parameter_value touch_panel_pen_irq_n direction Input
set_instance_parameter_value touch_panel_pen_irq_n edgeType FALLING
set_instance_parameter_value touch_panel_pen_irq_n generateIRQ true
set_instance_parameter_value touch_panel_pen_irq_n irqType EDGE
set_instance_parameter_value touch_panel_pen_irq_n simDoTestBenchWiring true
set_instance_parameter_value touch_panel_pen_irq_n width 1

add_instance touch_panel_spi altera_avalon_spi 12.1
set_instance_parameter_value touch_panel_spi clockPolarity 0
set_instance_parameter_value touch_panel_spi dataWidth 8
set_instance_parameter_value touch_panel_spi masterSPI true
set_instance_parameter_value touch_panel_spi numberOfSlaves 1
set_instance_parameter_value touch_panel_spi targetClockRate 32000

add_instance el_camino_sd_card_controller altera_avalon_sd_mmc_spi 1.1
set_instance_parameter_value el_camino_sd_card_controller system_clock_frequency 60
set_instance_parameter_value el_camino_sd_card_controller spi_clock_frequency 20

add_instance remote_update altera_avalon_remote_update_cycloneiii 10.1
set_instance_parameter_value remote_update clockFrequency 40000000

add_instance lcd_ta_sgdma_to_fifo timing_adapter 12.1
set_instance_parameter_value lcd_ta_sgdma_to_fifo inBitsPerSymbol 8
set_instance_parameter_value lcd_ta_sgdma_to_fifo inChannelWidth 0
set_instance_parameter_value lcd_ta_sgdma_to_fifo inErrorWidth 0
set_instance_parameter_value lcd_ta_sgdma_to_fifo inMaxChannel 0
set_instance_parameter_value lcd_ta_sgdma_to_fifo inReadyLatency 0
set_instance_parameter_value lcd_ta_sgdma_to_fifo inSymbolsPerBeat 8
set_instance_parameter_value lcd_ta_sgdma_to_fifo inUseEmptyPort AUTO
set_instance_parameter_value lcd_ta_sgdma_to_fifo inUsePackets true
set_instance_parameter_value lcd_ta_sgdma_to_fifo inUseReady true
set_instance_parameter_value lcd_ta_sgdma_to_fifo inUseValid true
set_instance_parameter_value lcd_ta_sgdma_to_fifo outReadyLatency 1
set_instance_parameter_value lcd_ta_sgdma_to_fifo outUseReady true
set_instance_parameter_value lcd_ta_sgdma_to_fifo outUseValid true

add_instance lcd_pixel_fifo altera_avalon_fifo 12.1
set_instance_parameter_value lcd_pixel_fifo bitsPerSymbol 8
set_instance_parameter_value lcd_pixel_fifo channelWidth 0
set_instance_parameter_value lcd_pixel_fifo errorWidth 0
set_instance_parameter_value lcd_pixel_fifo fifoDepth 128
set_instance_parameter_value lcd_pixel_fifo fifoInputInterfaceOptions AVALONST_SINK
set_instance_parameter_value lcd_pixel_fifo fifoOutputInterfaceOptions AVALONST_SOURCE
set_instance_parameter_value lcd_pixel_fifo singleClockMode false
set_instance_parameter_value lcd_pixel_fifo symbolsPerBeat 8
set_instance_parameter_value lcd_pixel_fifo useIRQ false
set_instance_parameter_value lcd_pixel_fifo usePacket true
set_instance_parameter_value lcd_pixel_fifo useReadControl false
set_instance_parameter_value lcd_pixel_fifo useWriteControl false

add_instance lcd_ta_fifo_to_dfa timing_adapter 12.1
set_instance_parameter_value lcd_ta_fifo_to_dfa inBitsPerSymbol 8
set_instance_parameter_value lcd_ta_fifo_to_dfa inChannelWidth 0
set_instance_parameter_value lcd_ta_fifo_to_dfa inErrorWidth 0
set_instance_parameter_value lcd_ta_fifo_to_dfa inMaxChannel 0
set_instance_parameter_value lcd_ta_fifo_to_dfa inReadyLatency 1
set_instance_parameter_value lcd_ta_fifo_to_dfa inSymbolsPerBeat 8
set_instance_parameter_value lcd_ta_fifo_to_dfa inUseEmptyPort AUTO
set_instance_parameter_value lcd_ta_fifo_to_dfa inUsePackets true
set_instance_parameter_value lcd_ta_fifo_to_dfa inUseReady true
set_instance_parameter_value lcd_ta_fifo_to_dfa inUseValid true
set_instance_parameter_value lcd_ta_fifo_to_dfa outReadyLatency 0
set_instance_parameter_value lcd_ta_fifo_to_dfa outUseReady true
set_instance_parameter_value lcd_ta_fifo_to_dfa outUseValid true

add_instance lcd_64_to_32_bits_dfa data_format_adapter 12.1
set_instance_parameter_value lcd_64_to_32_bits_dfa generationLanguage VERILOG
set_instance_parameter_value lcd_64_to_32_bits_dfa inBitsPerSymbol 8
set_instance_parameter_value lcd_64_to_32_bits_dfa inChannelWidth 0
set_instance_parameter_value lcd_64_to_32_bits_dfa inErrorWidth 0
set_instance_parameter_value lcd_64_to_32_bits_dfa inMaxChannel 0
set_instance_parameter_value lcd_64_to_32_bits_dfa inReadyLatency 0
set_instance_parameter_value lcd_64_to_32_bits_dfa inSymbolsPerBeat 8
set_instance_parameter_value lcd_64_to_32_bits_dfa inUseEmpty false
set_instance_parameter_value lcd_64_to_32_bits_dfa inUseEmptyPort AUTO
set_instance_parameter_value lcd_64_to_32_bits_dfa inUsePackets true
set_instance_parameter_value lcd_64_to_32_bits_dfa inUseReady true
set_instance_parameter_value lcd_64_to_32_bits_dfa moduleName lcd_64_to_32_bits_dfa
set_instance_parameter_value lcd_64_to_32_bits_dfa outSymbolsPerBeat 4
set_instance_parameter_value lcd_64_to_32_bits_dfa outUseEmpty false
set_instance_parameter_value lcd_64_to_32_bits_dfa outUseEmptyPort AUTO

add_instance lcd_pixel_converter altera_avalon_pixel_converter 10.1
set_instance_parameter_value lcd_pixel_converter SOURCE_SYMBOLS_PER_BEAT 3

add_instance lcd_32_to_8_bits_dfa data_format_adapter 12.1
set_instance_parameter_value lcd_32_to_8_bits_dfa generationLanguage VERILOG
set_instance_parameter_value lcd_32_to_8_bits_dfa inBitsPerSymbol 8
set_instance_parameter_value lcd_32_to_8_bits_dfa inChannelWidth 0
set_instance_parameter_value lcd_32_to_8_bits_dfa inErrorWidth 0
set_instance_parameter_value lcd_32_to_8_bits_dfa inMaxChannel 0
set_instance_parameter_value lcd_32_to_8_bits_dfa inReadyLatency 0
set_instance_parameter_value lcd_32_to_8_bits_dfa inSymbolsPerBeat 3
set_instance_parameter_value lcd_32_to_8_bits_dfa inUseEmpty false
set_instance_parameter_value lcd_32_to_8_bits_dfa inUseEmptyPort AUTO
set_instance_parameter_value lcd_32_to_8_bits_dfa inUsePackets true
set_instance_parameter_value lcd_32_to_8_bits_dfa inUseReady true
set_instance_parameter_value lcd_32_to_8_bits_dfa moduleName lcd_32_to_8_bits_dfa
set_instance_parameter_value lcd_32_to_8_bits_dfa outSymbolsPerBeat 1
set_instance_parameter_value lcd_32_to_8_bits_dfa outUseEmpty true
set_instance_parameter_value lcd_32_to_8_bits_dfa outUseEmptyPort AUTO

add_instance lcd_sync_generator altera_avalon_video_sync_generator 10.1
set_instance_parameter_value lcd_sync_generator DATA_STREAM_BIT_WIDTH 8
set_instance_parameter_value lcd_sync_generator BEATS_PER_PIXEL 3
set_instance_parameter_value lcd_sync_generator NUM_COLUMNS 800
set_instance_parameter_value lcd_sync_generator NUM_ROWS 480
set_instance_parameter_value lcd_sync_generator H_BLANK_PIXELS 216
set_instance_parameter_value lcd_sync_generator H_FRONT_PORCH_PIXELS 40
set_instance_parameter_value lcd_sync_generator H_SYNC_PULSE_PIXELS 1
set_instance_parameter_value lcd_sync_generator H_SYNC_PULSE_POLARITY 0
set_instance_parameter_value lcd_sync_generator V_BLANK_LINES 35
set_instance_parameter_value lcd_sync_generator V_FRONT_PORCH_LINES 10
set_instance_parameter_value lcd_sync_generator V_SYNC_PULSE_LINES 1
set_instance_parameter_value lcd_sync_generator V_SYNC_PULSE_POLARITY 0
set_instance_parameter_value lcd_sync_generator TOTAL_HSCAN_PIXELS 1056
set_instance_parameter_value lcd_sync_generator TOTAL_VSCAN_LINES 525

# connections
add_connection clk.clk ddr_sdram.refclk clock
add_connection clk.clk pll.inclk0 clock
add_connection ddr_sdram.sysclk cpu_ddr_clock_bridge.m0_clk clock
add_connection ddr_sdram.sysclk lcd_pixel_fifo.clk_in clock
add_connection ddr_sdram.sysclk lcd_sgdma.clk clock
add_connection ddr_sdram.sysclk lcd_ta_sgdma_to_fifo.clk clock
add_connection ddr_sdram.sysclk sysclk.in_clk clock
add_connection ddr_sdram.sysclk tse_ddr_clock_bridge.m0_clk clock
add_connection pll.c0 c0.in_clk clock
add_connection pll.c0 cpu.clk clock
add_connection pll.c0 cpu_ddr_clock_bridge.s0_clk clock
add_connection pll.c0 ext_flash.clk clock
add_connection pll.c0 flash_ssram_pipeline_bridge.clk clock
add_connection pll.c0 flash_ssram_tristate_bridge_bridge_0.clk clock
add_connection pll.c0 flash_ssram_tristate_bridge_pinSharer_0.clk clock
add_connection pll.c0 lcd_32_to_8_bits_dfa.clk clock
add_connection pll.c0 lcd_64_to_32_bits_dfa.clk clock
add_connection pll.c0 lcd_pixel_converter.clk clock
add_connection pll.c0 lcd_pixel_fifo.clk_out clock
add_connection pll.c0 lcd_sync_generator.clk clock
add_connection pll.c0 lcd_ta_fifo_to_dfa.clk clock
add_connection pll.c0 pipeline_bridge_before_tristate_bridge.clk clock
add_connection pll.c0 slow_peripheral_bridge.s0_clk clock
add_connection pll.c0 ssram.clk clock
add_connection pll.c0 tse_ssram_clock_bridge.m0_clk clock
add_connection pll.c2 button_pio.clk clock
add_connection pll.c2 c2.in_clk clock
add_connection pll.c2 descriptor_memory.clk1 clock
add_connection pll.c2 descriptor_offset_bridge.clk clock
add_connection pll.c2 el_camino_sd_card_controller.avalon_slave_clock clock
add_connection pll.c2 high_res_timer.clk clock
add_connection pll.c2 jtag_uart.clk clock
add_connection pll.c2 lcd_i2c_en.clk clock
add_connection pll.c2 lcd_i2c_scl.clk clock
add_connection pll.c2 lcd_i2c_sdat.clk clock
add_connection pll.c2 led_pio.clk clock
add_connection pll.c2 performance_counter.clk clock
add_connection pll.c2 pio_id_eeprom_dat.clk clock
add_connection pll.c2 pio_id_eeprom_scl.clk clock
add_connection pll.c2 sgdma_rx.clk clock
add_connection pll.c2 sgdma_tx.clk clock
add_connection pll.c2 slow_peripheral_bridge.m0_clk clock
add_connection pll.c2 sys_clk_timer.clk clock
add_connection pll.c2 sysid.clk clock
add_connection pll.c2 touch_panel_pen_irq_n.clk clock
add_connection pll.c2 touch_panel_spi.clk clock
add_connection pll.c2 tse_ddr_clock_bridge.s0_clk clock
add_connection pll.c2 tse_mac.control_port_clock_connection clock
add_connection pll.c2 tse_mac.receive_clock_connection clock
add_connection pll.c2 tse_mac.transmit_clock_connection clock
add_connection pll.c2 tse_ssram_clock_bridge.s0_clk clock
add_connection pll.c2 uart1.clk clock
add_connection pll.c3 c3.in_clk clock
add_connection pll.c3 remote_update.global_signals_clock clock
add_connection clk.clk_reset button_pio.reset reset
add_connection clk.clk_reset cpu.reset_n reset
add_connection clk.clk_reset cpu_ddr_clock_bridge.m0_reset reset
add_connection clk.clk_reset cpu_ddr_clock_bridge.s0_reset reset
add_connection clk.clk_reset ddr_sdram.soft_reset_n reset
add_connection clk.clk_reset descriptor_memory.reset1 reset
add_connection clk.clk_reset descriptor_offset_bridge.reset reset
add_connection clk.clk_reset el_camino_sd_card_controller.avalon_slave_clock_reset reset
add_connection clk.clk_reset ext_flash.reset reset
add_connection clk.clk_reset flash_ssram_pipeline_bridge.reset reset
add_connection clk.clk_reset flash_ssram_tristate_bridge_bridge_0.reset reset
add_connection clk.clk_reset flash_ssram_tristate_bridge_pinSharer_0.reset reset
add_connection clk.clk_reset high_res_timer.reset reset
add_connection clk.clk_reset jtag_uart.reset reset
add_connection clk.clk_reset lcd_32_to_8_bits_dfa.reset reset
add_connection clk.clk_reset lcd_64_to_32_bits_dfa.reset reset
add_connection clk.clk_reset lcd_i2c_en.reset reset
add_connection clk.clk_reset lcd_i2c_scl.reset reset
add_connection clk.clk_reset lcd_i2c_sdat.reset reset
add_connection clk.clk_reset lcd_pixel_converter.clk_reset reset
add_connection clk.clk_reset lcd_pixel_fifo.reset_in reset
add_connection clk.clk_reset lcd_pixel_fifo.reset_out reset
add_connection clk.clk_reset lcd_sgdma.reset reset
add_connection clk.clk_reset lcd_sync_generator.clk_reset reset
add_connection clk.clk_reset lcd_ta_fifo_to_dfa.reset reset
add_connection clk.clk_reset lcd_ta_sgdma_to_fifo.reset reset
add_connection clk.clk_reset led_pio.reset reset
add_connection clk.clk_reset performance_counter.reset reset
add_connection clk.clk_reset pio_id_eeprom_dat.reset reset
add_connection clk.clk_reset pio_id_eeprom_scl.reset reset
add_connection clk.clk_reset pipeline_bridge_before_tristate_bridge.reset reset
add_connection clk.clk_reset pll.reset reset
add_connection clk.clk_reset remote_update.global_signals_clock_reset reset
add_connection clk.clk_reset sgdma_rx.reset reset
add_connection clk.clk_reset sgdma_tx.reset reset
add_connection clk.clk_reset slow_peripheral_bridge.m0_reset reset
add_connection clk.clk_reset slow_peripheral_bridge.s0_reset reset
add_connection clk.clk_reset ssram.reset reset
add_connection clk.clk_reset sys_clk_timer.reset reset
add_connection clk.clk_reset sysid.reset reset
add_connection clk.clk_reset touch_panel_pen_irq_n.reset reset
add_connection clk.clk_reset touch_panel_spi.reset reset
add_connection clk.clk_reset tse_ddr_clock_bridge.m0_reset reset
add_connection clk.clk_reset tse_ddr_clock_bridge.s0_reset reset
add_connection clk.clk_reset tse_mac.reset_connection reset
add_connection clk.clk_reset tse_ssram_clock_bridge.m0_reset reset
add_connection clk.clk_reset tse_ssram_clock_bridge.s0_reset reset
add_connection clk.clk_reset uart1.reset reset
add_connection cpu.jtag_debug_module_reset button_pio.reset reset
add_connection cpu.jtag_debug_module_reset cpu.reset_n reset
add_connection cpu.jtag_debug_module_reset cpu_ddr_clock_bridge.m0_reset reset
add_connection cpu.jtag_debug_module_reset cpu_ddr_clock_bridge.s0_reset reset
add_connection cpu.jtag_debug_module_reset ddr_sdram.soft_reset_n reset
add_connection cpu.jtag_debug_module_reset descriptor_memory.reset1 reset
add_connection cpu.jtag_debug_module_reset descriptor_offset_bridge.reset reset
add_connection cpu.jtag_debug_module_reset el_camino_sd_card_controller.avalon_slave_clock_reset reset
add_connection cpu.jtag_debug_module_reset ext_flash.reset reset
add_connection cpu.jtag_debug_module_reset flash_ssram_pipeline_bridge.reset reset
add_connection cpu.jtag_debug_module_reset flash_ssram_tristate_bridge_bridge_0.reset reset
add_connection cpu.jtag_debug_module_reset flash_ssram_tristate_bridge_pinSharer_0.reset reset
add_connection cpu.jtag_debug_module_reset high_res_timer.reset reset
add_connection cpu.jtag_debug_module_reset jtag_uart.reset reset
add_connection cpu.jtag_debug_module_reset lcd_32_to_8_bits_dfa.reset reset
add_connection cpu.jtag_debug_module_reset lcd_64_to_32_bits_dfa.reset reset
add_connection cpu.jtag_debug_module_reset lcd_i2c_en.reset reset
add_connection cpu.jtag_debug_module_reset lcd_i2c_scl.reset reset
add_connection cpu.jtag_debug_module_reset lcd_i2c_sdat.reset reset
add_connection cpu.jtag_debug_module_reset lcd_pixel_converter.clk_reset reset
add_connection cpu.jtag_debug_module_reset lcd_pixel_fifo.reset_in reset
add_connection cpu.jtag_debug_module_reset lcd_pixel_fifo.reset_out reset
add_connection cpu.jtag_debug_module_reset lcd_sgdma.reset reset
add_connection cpu.jtag_debug_module_reset lcd_sync_generator.clk_reset reset
add_connection cpu.jtag_debug_module_reset lcd_ta_fifo_to_dfa.reset reset
add_connection cpu.jtag_debug_module_reset lcd_ta_sgdma_to_fifo.reset reset
add_connection cpu.jtag_debug_module_reset led_pio.reset reset
add_connection cpu.jtag_debug_module_reset performance_counter.reset reset
add_connection cpu.jtag_debug_module_reset pio_id_eeprom_dat.reset reset
add_connection cpu.jtag_debug_module_reset pio_id_eeprom_scl.reset reset
add_connection cpu.jtag_debug_module_reset pipeline_bridge_before_tristate_bridge.reset reset
add_connection cpu.jtag_debug_module_reset pll.reset reset
add_connection cpu.jtag_debug_module_reset remote_update.global_signals_clock_reset reset
add_connection cpu.jtag_debug_module_reset sgdma_rx.reset reset
add_connection cpu.jtag_debug_module_reset sgdma_tx.reset reset
add_connection cpu.jtag_debug_module_reset slow_peripheral_bridge.m0_reset reset
add_connection cpu.jtag_debug_module_reset slow_peripheral_bridge.s0_reset reset
add_connection cpu.jtag_debug_module_reset ssram.reset reset
add_connection cpu.jtag_debug_module_reset sys_clk_timer.reset reset
add_connection cpu.jtag_debug_module_reset sysid.reset reset
add_connection cpu.jtag_debug_module_reset touch_panel_pen_irq_n.reset reset
add_connection cpu.jtag_debug_module_reset touch_panel_spi.reset reset
add_connection cpu.jtag_debug_module_reset tse_ddr_clock_bridge.m0_reset reset
add_connection cpu.jtag_debug_module_reset tse_ddr_clock_bridge.s0_reset reset
add_connection cpu.jtag_debug_module_reset tse_mac.reset_connection reset
add_connection cpu.jtag_debug_module_reset tse_ssram_clock_bridge.m0_reset reset
add_connection cpu.jtag_debug_module_reset tse_ssram_clock_bridge.s0_reset reset
add_connection cpu.jtag_debug_module_reset uart1.reset reset
